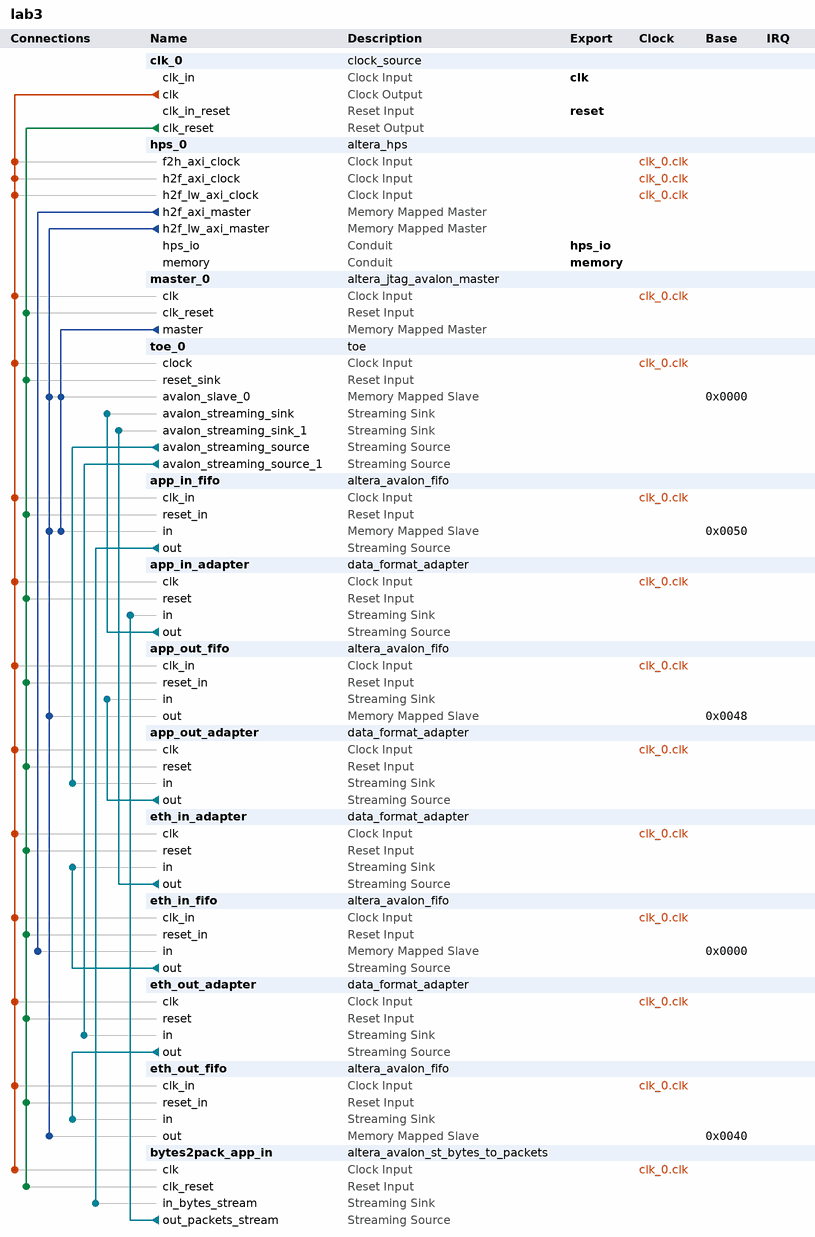
[diagram p0: system contents]
# Platform Designer (Qsys) system lab3, Cyclone V 5CSXFC6D6F31C8ES
# Parameters at their usual value, and those the tool derives, are not listed.
package require -exact qsys 13.1
create_system lab3
set_project_property DEVICE_FAMILY {Cyclone V}
set_project_property DEVICE 5CSXFC6D6F31C8ES

add_instance clk_0 clock_source 13.1
set_instance_parameter_value clk_0 clockFrequency 50000000

add_instance hps_0 altera_hps 13.1.1
set_instance_parameter_value hps_0 MEM_VENDOR Micron
set_instance_parameter_value hps_0 MEM_ROW_ADDR_WIDTH 15
set_instance_parameter_value hps_0 MEM_COL_ADDR_WIDTH 10
set_instance_parameter_value hps_0 MEM_DQ_WIDTH 32
set_instance_parameter_value hps_0 MEM_BANKADDR_WIDTH 3
set_instance_parameter_value hps_0 MEM_DRV_STR RZQ/7
set_instance_parameter_value hps_0 MEM_RTT_NOM RZQ/4
set_instance_parameter_value hps_0 MEM_RTT_WR RZQ/4
set_instance_parameter_value hps_0 MEM_WTCL 8
set_instance_parameter_value hps_0 MEM_TCL 11
set_instance_parameter_value hps_0 TIMING_TIS 180
set_instance_parameter_value hps_0 TIMING_TIH 140
set_instance_parameter_value hps_0 TIMING_TDS 30
set_instance_parameter_value hps_0 TIMING_TDH 65
set_instance_parameter_value hps_0 TIMING_TDQSQ 125
set_instance_parameter_value hps_0 TIMING_TDQSCK 255
set_instance_parameter_value hps_0 TIMING_TQSH 0.4
set_instance_parameter_value hps_0 MEM_TRAS_NS 35.0
set_instance_parameter_value hps_0 MEM_TRCD_NS 13.75
set_instance_parameter_value hps_0 MEM_TRP_NS 13.75
set_instance_parameter_value hps_0 MEM_TRFC_NS 260.0
set_instance_parameter_value hps_0 MEM_TFAW_NS 30.0
set_instance_parameter_value hps_0 REF_CLK_FREQ 25.0
set_instance_parameter_value hps_0 DEFAULT_FAST_SIM_MODEL true
set_instance_parameter_value hps_0 TIMING_BOARD_MAX_CK_DELAY 0.03
set_instance_parameter_value hps_0 TIMING_BOARD_MAX_DQS_DELAY 0.02
set_instance_parameter_value hps_0 TIMING_BOARD_SKEW_CKDQS_DIMM_MIN 0.09
set_instance_parameter_value hps_0 TIMING_BOARD_SKEW_CKDQS_DIMM_MAX 0.16
set_instance_parameter_value hps_0 TIMING_BOARD_SKEW_WITHIN_DQS 0.01
set_instance_parameter_value hps_0 TIMING_BOARD_SKEW_BETWEEN_DQS 0.08
set_instance_parameter_value hps_0 TIMING_BOARD_DQ_TO_DQS_SKEW 0.0
set_instance_parameter_value hps_0 TIMING_BOARD_AC_SKEW 0.03
set_instance_parameter_value hps_0 TIMING_BOARD_AC_TO_CK_SKEW 0.0
set_instance_parameter_value hps_0 MEM_CLK_FREQ 400.0
set_instance_parameter_value hps_0 HPS_PROTOCOL DDR3
set_instance_parameter_value hps_0 STM_Enable false
set_instance_parameter_value hps_0 F2S_Width 2
set_instance_parameter_value hps_0 S2F_Width 2
set_instance_parameter_value hps_0 LWH2F_Enable true
set_instance_parameter_value hps_0 F2SCLK_DBGRST_Enable false
set_instance_parameter_value hps_0 F2SCLK_WARMRST_Enable false
set_instance_parameter_value hps_0 F2SCLK_COLDRST_Enable false
set_instance_parameter_value hps_0 F2SINTERRUPT_Enable false
set_instance_parameter_value hps_0 EMAC1_PinMuxing {HPS I/O Set 0}
set_instance_parameter_value hps_0 EMAC1_Mode RGMII
set_instance_parameter_value hps_0 QSPI_PinMuxing {HPS I/O Set 0}
set_instance_parameter_value hps_0 QSPI_Mode {1 SS}
set_instance_parameter_value hps_0 SDIO_PinMuxing {HPS I/O Set 0}
set_instance_parameter_value hps_0 SDIO_Mode {4-bit Data}
set_instance_parameter_value hps_0 USB1_PinMuxing {HPS I/O Set 0}
set_instance_parameter_value hps_0 USB1_Mode SDR
set_instance_parameter_value hps_0 SPIM0_PinMuxing {HPS I/O Set 0}
set_instance_parameter_value hps_0 SPIM0_Mode {Single Slave Select}
set_instance_parameter_value hps_0 SPIM1_PinMuxing {HPS I/O Set 0}
set_instance_parameter_value hps_0 SPIM1_Mode {Single Slave Select}
set_instance_parameter_value hps_0 UART0_PinMuxing {HPS I/O Set 0}
set_instance_parameter_value hps_0 UART0_Mode {No Flow Control}
set_instance_parameter_value hps_0 I2C0_PinMuxing Unused
set_instance_parameter_value hps_0 I2C0_Mode N/A
set_instance_parameter_value hps_0 I2C1_PinMuxing {HPS I/O Set 0}
set_instance_parameter_value hps_0 I2C1_Mode I2C
set_instance_parameter_value hps_0 S2FCLK_USER1CLK_FREQ 100
set_instance_parameter_value hps_0 FPGA_PERIPHERAL_OUTPUT_CLOCK_FREQ_EMAC0_MD_CLK 100
set_instance_parameter_value hps_0 FPGA_PERIPHERAL_OUTPUT_CLOCK_FREQ_EMAC0_GTX_CLK 100
set_instance_parameter_value hps_0 FPGA_PERIPHERAL_OUTPUT_CLOCK_FREQ_EMAC1_MD_CLK 100
set_instance_parameter_value hps_0 FPGA_PERIPHERAL_OUTPUT_CLOCK_FREQ_EMAC1_GTX_CLK 100

add_instance master_0 altera_jtag_avalon_master 13.1

add_instance toe_0 toe 1.0

add_instance app_in_fifo altera_avalon_fifo 13.1
set_instance_parameter_value app_in_fifo bitsPerSymbol 8
set_instance_parameter_value app_in_fifo channelWidth 0
set_instance_parameter_value app_in_fifo errorWidth 0
set_instance_parameter_value app_in_fifo fifoDepth 8192
set_instance_parameter_value app_in_fifo fifoInputInterfaceOptions AVALONMM_WRITE
set_instance_parameter_value app_in_fifo fifoOutputInterfaceOptions AVALONST_SOURCE
set_instance_parameter_value app_in_fifo singleClockMode true
set_instance_parameter_value app_in_fifo singleResetMode true
set_instance_parameter_value app_in_fifo symbolsPerBeat 4
set_instance_parameter_value app_in_fifo useIRQ true
set_instance_parameter_value app_in_fifo usePacket false
set_instance_parameter_value app_in_fifo useReadControl false
set_instance_parameter_value app_in_fifo useWriteControl false

add_instance app_in_adapter data_format_adapter 13.1
set_instance_parameter_value app_in_adapter generationLanguage VERILOG
set_instance_parameter_value app_in_adapter inBitsPerSymbol 8
set_instance_parameter_value app_in_adapter inChannelWidth 0
set_instance_parameter_value app_in_adapter inErrorWidth 0
set_instance_parameter_value app_in_adapter inMaxChannel 0
set_instance_parameter_value app_in_adapter inReadyLatency 0
set_instance_parameter_value app_in_adapter inSymbolsPerBeat 1
set_instance_parameter_value app_in_adapter inUseEmpty false
set_instance_parameter_value app_in_adapter inUseEmptyPort AUTO
set_instance_parameter_value app_in_adapter inUsePackets true
set_instance_parameter_value app_in_adapter inUseReady true
set_instance_parameter_value app_in_adapter outSymbolsPerBeat 8
set_instance_parameter_value app_in_adapter outUseEmpty false
set_instance_parameter_value app_in_adapter outUseEmptyPort AUTO

add_instance app_out_fifo altera_avalon_fifo 13.1
set_instance_parameter_value app_out_fifo bitsPerSymbol 8
set_instance_parameter_value app_out_fifo channelWidth 0
set_instance_parameter_value app_out_fifo errorWidth 0
set_instance_parameter_value app_out_fifo fifoDepth 8192
set_instance_parameter_value app_out_fifo fifoInputInterfaceOptions AVALONST_SINK
set_instance_parameter_value app_out_fifo fifoOutputInterfaceOptions AVALONMM_READ
set_instance_parameter_value app_out_fifo singleClockMode true
set_instance_parameter_value app_out_fifo singleResetMode true
set_instance_parameter_value app_out_fifo symbolsPerBeat 4
set_instance_parameter_value app_out_fifo useIRQ false
set_instance_parameter_value app_out_fifo usePacket true
set_instance_parameter_value app_out_fifo useReadControl false
set_instance_parameter_value app_out_fifo useWriteControl false

add_instance app_out_adapter data_format_adapter 13.1
set_instance_parameter_value app_out_adapter generationLanguage VERILOG
set_instance_parameter_value app_out_adapter inBitsPerSymbol 8
set_instance_parameter_value app_out_adapter inChannelWidth 0
set_instance_parameter_value app_out_adapter inErrorWidth 0
set_instance_parameter_value app_out_adapter inMaxChannel 0
set_instance_parameter_value app_out_adapter inReadyLatency 0
set_instance_parameter_value app_out_adapter inSymbolsPerBeat 8
set_instance_parameter_value app_out_adapter inUseEmpty false
set_instance_parameter_value app_out_adapter inUseEmptyPort AUTO
set_instance_parameter_value app_out_adapter inUsePackets true
set_instance_parameter_value app_out_adapter inUseReady true
set_instance_parameter_value app_out_adapter outSymbolsPerBeat 4
set_instance_parameter_value app_out_adapter outUseEmpty false
set_instance_parameter_value app_out_adapter outUseEmptyPort AUTO

add_instance eth_in_adapter data_format_adapter 13.1
set_instance_parameter_value eth_in_adapter generationLanguage VERILOG
set_instance_parameter_value eth_in_adapter inBitsPerSymbol 8
set_instance_parameter_value eth_in_adapter inChannelWidth 0
set_instance_parameter_value eth_in_adapter inErrorWidth 0
set_instance_parameter_value eth_in_adapter inMaxChannel 0
set_instance_parameter_value eth_in_adapter inReadyLatency 0
set_instance_parameter_value eth_in_adapter inSymbolsPerBeat 4
set_instance_parameter_value eth_in_adapter inUseEmpty false
set_instance_parameter_value eth_in_adapter inUseEmptyPort YES
set_instance_parameter_value eth_in_adapter inUsePackets true
set_instance_parameter_value eth_in_adapter inUseReady true
set_instance_parameter_value eth_in_adapter outSymbolsPerBeat 8
set_instance_parameter_value eth_in_adapter outUseEmpty false
set_instance_parameter_value eth_in_adapter outUseEmptyPort YES

add_instance eth_in_fifo altera_avalon_fifo 13.1
set_instance_parameter_value eth_in_fifo bitsPerSymbol 8
set_instance_parameter_value eth_in_fifo channelWidth 0
set_instance_parameter_value eth_in_fifo errorWidth 0
set_instance_parameter_value eth_in_fifo fifoDepth 8192
set_instance_parameter_value eth_in_fifo fifoInputInterfaceOptions AVALONMM_WRITE
set_instance_parameter_value eth_in_fifo fifoOutputInterfaceOptions AVALONST_SOURCE
set_instance_parameter_value eth_in_fifo singleClockMode true
set_instance_parameter_value eth_in_fifo singleResetMode true
set_instance_parameter_value eth_in_fifo symbolsPerBeat 4
set_instance_parameter_value eth_in_fifo useIRQ true
set_instance_parameter_value eth_in_fifo usePacket true
set_instance_parameter_value eth_in_fifo useReadControl false
set_instance_parameter_value eth_in_fifo useWriteControl false

add_instance eth_out_adapter data_format_adapter 13.1
set_instance_parameter_value eth_out_adapter generationLanguage VERILOG
set_instance_parameter_value eth_out_adapter inBitsPerSymbol 8
set_instance_parameter_value eth_out_adapter inChannelWidth 0
set_instance_parameter_value eth_out_adapter inErrorWidth 0
set_instance_parameter_value eth_out_adapter inMaxChannel 0
set_instance_parameter_value eth_out_adapter inReadyLatency 0
set_instance_parameter_value eth_out_adapter inSymbolsPerBeat 8
set_instance_parameter_value eth_out_adapter inUseEmpty false
set_instance_parameter_value eth_out_adapter inUseEmptyPort YES
set_instance_parameter_value eth_out_adapter inUsePackets true
set_instance_parameter_value eth_out_adapter inUseReady true
set_instance_parameter_value eth_out_adapter outSymbolsPerBeat 4
set_instance_parameter_value eth_out_adapter outUseEmpty false
set_instance_parameter_value eth_out_adapter outUseEmptyPort YES

add_instance eth_out_fifo altera_avalon_fifo 13.1
set_instance_parameter_value eth_out_fifo bitsPerSymbol 8
set_instance_parameter_value eth_out_fifo channelWidth 0
set_instance_parameter_value eth_out_fifo errorWidth 0
set_instance_parameter_value eth_out_fifo fifoDepth 8192
set_instance_parameter_value eth_out_fifo fifoInputInterfaceOptions AVALONST_SINK
set_instance_parameter_value eth_out_fifo fifoOutputInterfaceOptions AVALONMM_READ
set_instance_parameter_value eth_out_fifo singleClockMode true
set_instance_parameter_value eth_out_fifo symbolsPerBeat 4
set_instance_parameter_value eth_out_fifo useIRQ true
set_instance_parameter_value eth_out_fifo usePacket true
set_instance_parameter_value eth_out_fifo useReadControl false
set_instance_parameter_value eth_out_fifo useWriteControl false

add_instance bytes2pack_app_in altera_avalon_st_bytes_to_packets 13.1
set_instance_parameter_value bytes2pack_app_in CHANNEL_WIDTH 8
set_instance_parameter_value bytes2pack_app_in ENCODING 0

# connections
add_connection clk_0.clk app_in_adapter.clk clock
add_connection clk_0.clk app_in_fifo.clk_in clock
add_connection clk_0.clk app_out_adapter.clk clock
add_connection clk_0.clk app_out_fifo.clk_in clock
add_connection clk_0.clk bytes2pack_app_in.clk clock
add_connection clk_0.clk eth_in_adapter.clk clock
add_connection clk_0.clk eth_in_fifo.clk_in clock
add_connection clk_0.clk eth_out_adapter.clk clock
add_connection clk_0.clk eth_out_fifo.clk_in clock
add_connection clk_0.clk hps_0.f2h_axi_clock clock
add_connection clk_0.clk hps_0.h2f_axi_clock clock
add_connection clk_0.clk hps_0.h2f_lw_axi_clock clock
add_connection clk_0.clk master_0.clk clock
add_connection clk_0.clk toe_0.clock clock
add_connection clk_0.clk_reset app_in_adapter.reset reset
add_connection clk_0.clk_reset app_in_fifo.reset_in reset
add_connection clk_0.clk_reset app_out_adapter.reset reset
add_connection clk_0.clk_reset app_out_fifo.reset_in reset
add_connection clk_0.clk_reset bytes2pack_app_in.clk_reset reset
add_connection clk_0.clk_reset eth_in_adapter.reset reset
add_connection clk_0.clk_reset eth_in_fifo.reset_in reset
add_connection clk_0.clk_reset eth_out_adapter.reset reset
add_connection clk_0.clk_reset eth_out_fifo.reset_in reset
add_connection clk_0.clk_reset master_0.clk_reset reset
add_connection clk_0.clk_reset toe_0.reset_sink reset
add_connection hps_0.h2f_axi_master eth_in_fifo.in avalon
set_connection_parameter_value hps_0.h2f_axi_master/eth_in_fifo.in baseAddress 0x0000
add_connection hps_0.h2f_lw_axi_master app_in_fifo.in avalon
set_connection_parameter_value hps_0.h2f_lw_axi_master/app_in_fifo.in baseAddress 0x0050
add_connection hps_0.h2f_lw_axi_master app_out_fifo.out avalon
set_connection_parameter_value hps_0.h2f_lw_axi_master/app_out_fifo.out baseAddress 0x0048
add_connection hps_0.h2f_lw_axi_master eth_out_fifo.out avalon
set_connection_parameter_value hps_0.h2f_lw_axi_master/eth_out_fifo.out baseAddress 0x0040
add_connection hps_0.h2f_lw_axi_master toe_0.avalon_slave_0 avalon
set_connection_parameter_value hps_0.h2f_lw_axi_master/toe_0.avalon_slave_0 baseAddress 0x0000
add_connection master_0.master app_in_fifo.in avalon
set_connection_parameter_value master_0.master/app_in_fifo.in baseAddress 0x0050
add_connection master_0.master toe_0.avalon_slave_0 avalon
set_connection_parameter_value master_0.master/toe_0.avalon_slave_0 baseAddress 0x0000
add_connection app_in_adapter.out toe_0.avalon_streaming_sink avalon_streaming
add_connection app_in_fifo.out bytes2pack_app_in.in_bytes_stream avalon_streaming
add_connection app_out_adapter.out app_out_fifo.in avalon_streaming
add_connection bytes2pack_app_in.out_packets_stream app_in_adapter.in avalon_streaming
add_connection eth_in_adapter.out toe_0.avalon_streaming_sink_1 avalon_streaming
add_connection eth_in_fifo.out eth_in_adapter.in avalon_streaming
add_connection eth_out_adapter.out eth_out_fifo.in avalon_streaming
add_connection toe_0.avalon_streaming_source app_out_adapter.in avalon_streaming
add_connection toe_0.avalon_streaming_source_1 eth_out_adapter.in avalon_streaming

# exported interfaces
add_interface clk clock sink
set_interface_property clk EXPORT_OF clk_0.clk_in
add_interface reset reset sink
set_interface_property reset EXPORT_OF clk_0.clk_in_reset
add_interface memory conduit end
set_interface_property memory EXPORT_OF hps_0.memory
add_interface hps_io conduit end
set_interface_property hps_io EXPORT_OF hps_0.hps_io

set_interconnect_requirement {$system} qsys_mm.clockCrossingAdapter HANDSHAKE
set_interconnect_requirement {$system} qsys_mm.maxAdditionalLatency 1
set_interconnect_requirement {$system} qsys_mm.insertDefaultSlave false

save_system lab3.qsys
